# Altium schematic sheet LAN9254_B_P2.SchDoc
size 431 x 279 mm; DocumentNumber: 13; SheetNumber: 7; SheetTotal: 13
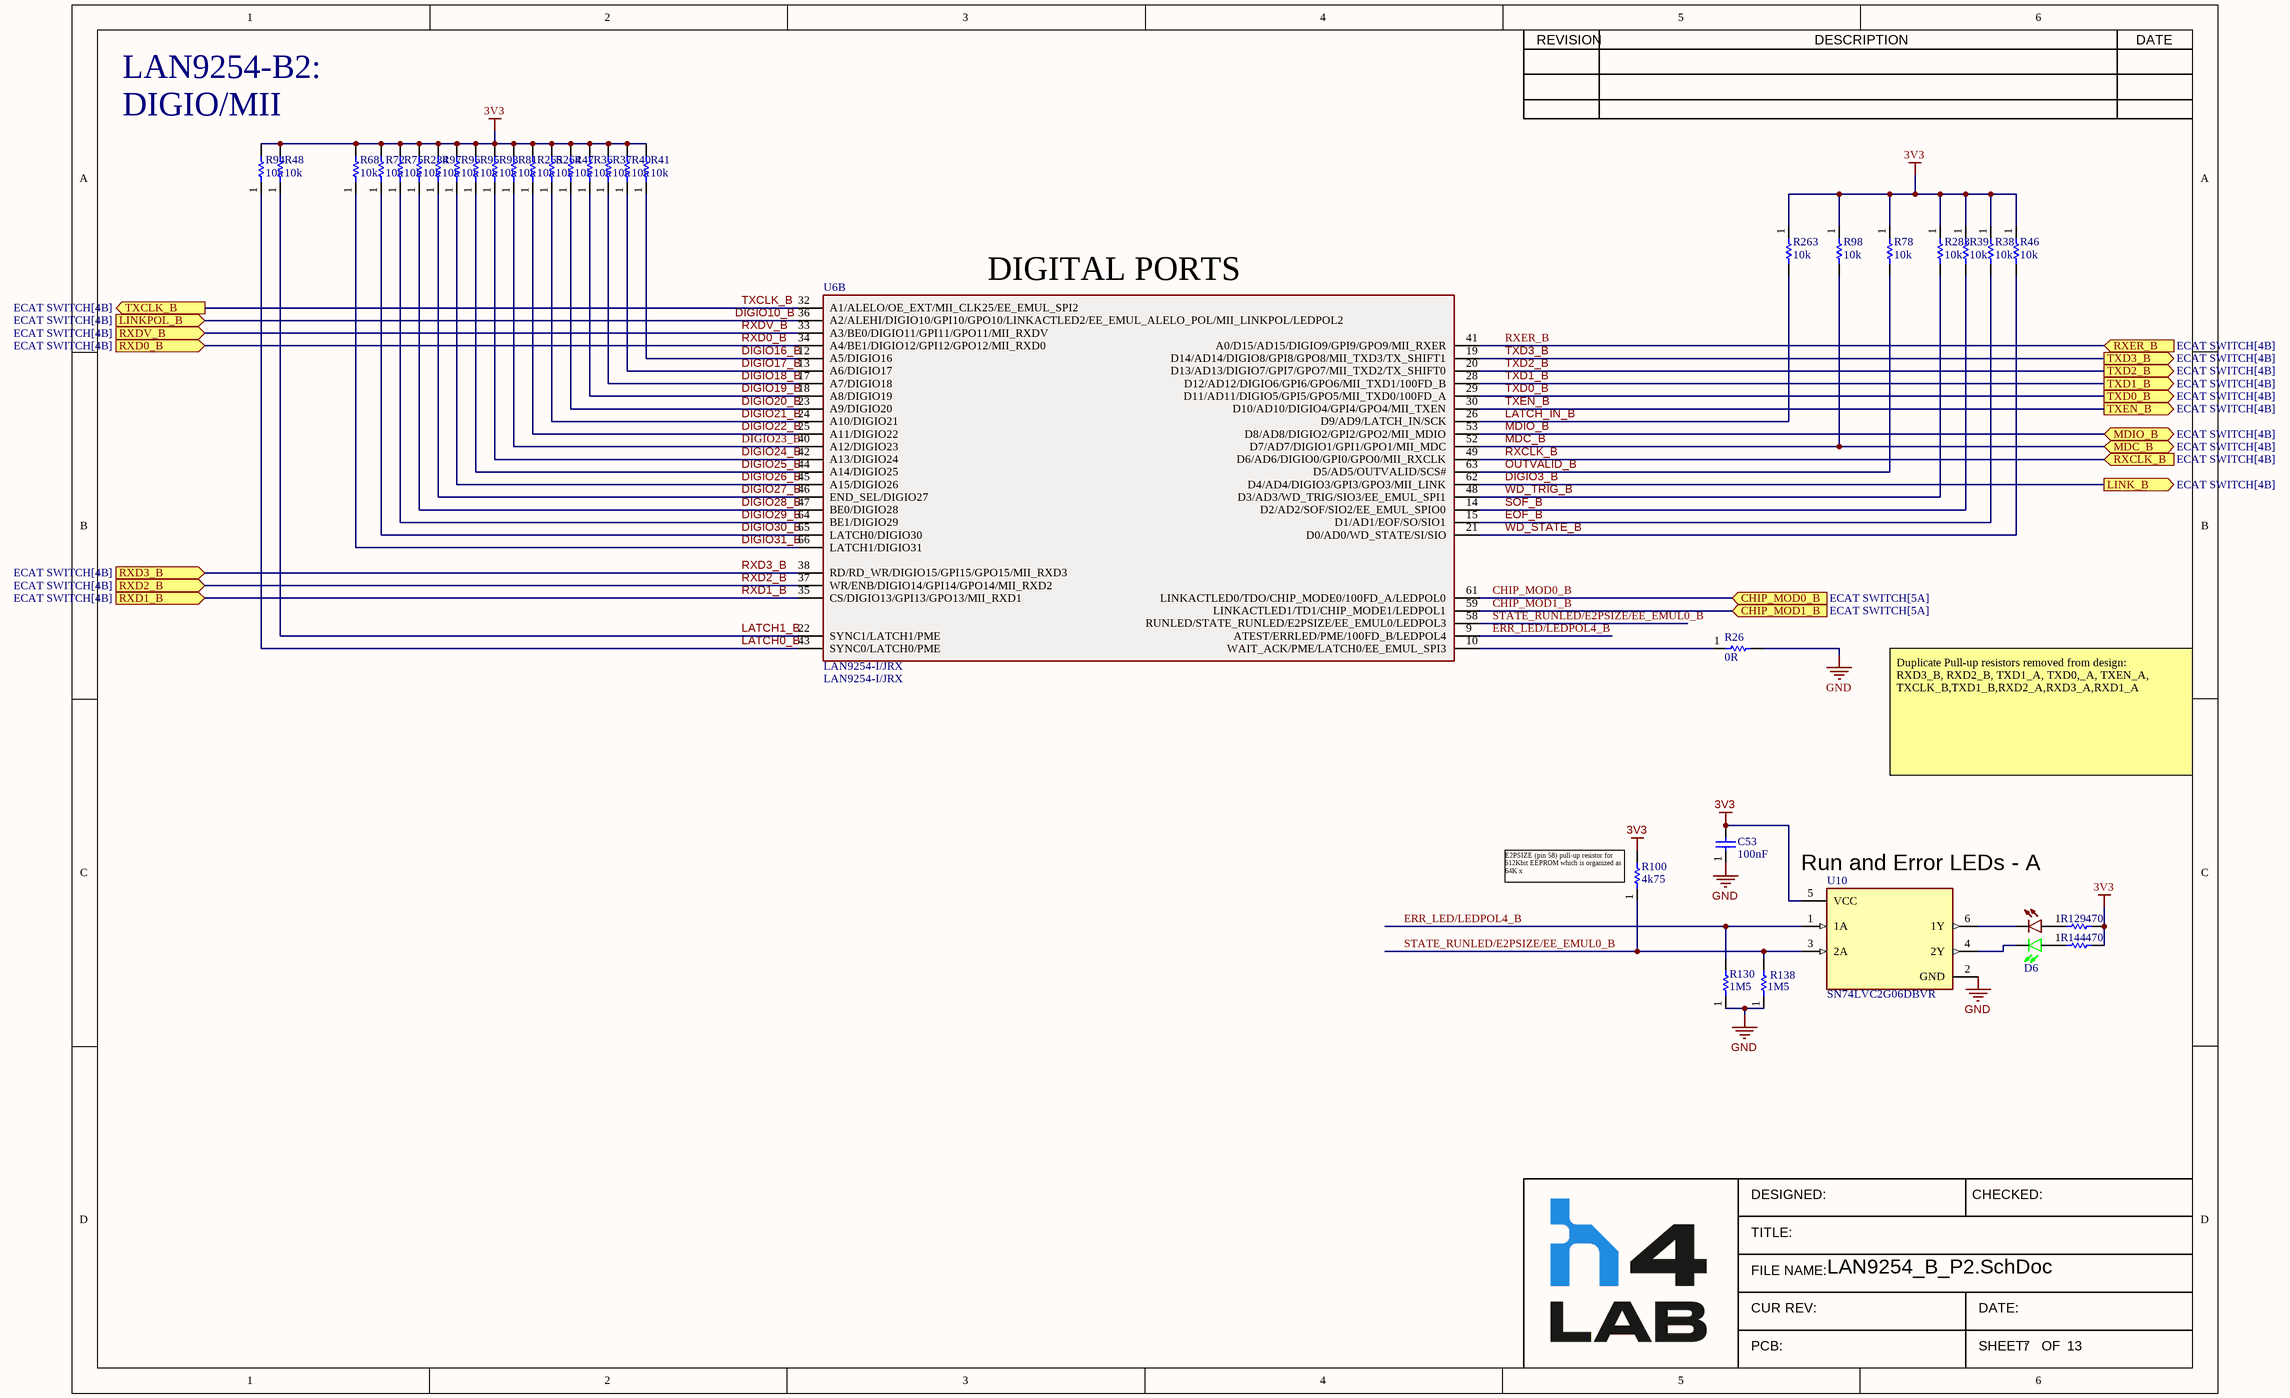
[diagram p0: LAN9254_B_P2.SchDoc]

## Parts
C53  value 100nF  [CAPC1005X03N(0402)]  (hidden comment: GRM155R71C104JA88D)
D6  LTST-C195KGJRKT  [Dual_LED]  (value not drawn)
R26  value 0R  [0402]  (hidden comment: RCS04020000Z0ED)
R36  value 10k  [RESC1005X06N(0402)]  (hidden comment: RC0402FR-0710KL)
R37  value 10k  [RESC1005X06N(0402)]  (hidden comment: RC0402FR-0710KL)
R38  value 10k  [RESC1005X06N(0402)]  (hidden comment: RC0402FR-0710KL)
R39  value 10k  [RESC1005X06N(0402)]  (hidden comment: RC0402FR-0710KL)
R40  value 10k  [RESC1005X06N(0402)]  (hidden comment: RC0402FR-0710KL)
R41  value 10k  [RESC1005X06N(0402)]  (hidden comment: RC0402FR-0710KL)
R46  value 10k  [RESC1005X06N(0402)]  (hidden comment: RC0402FR-0710KL)
R47  value 10k  [RESC1005X06N(0402)]  (hidden comment: RC0402FR-0710KL)
R48  value 10k  [RESC1005X06N(0402)]  (hidden comment: RC0402FR-0710KL)
R68  value 10k  [RESC1005X06N(0402)]  (hidden comment: RC0402FR-0710KL)
R72  value 10k  [RESC1005X06N(0402)]  (hidden comment: RC0402FR-0710KL)
R75  value 10k  [RESC1005X06N(0402)]  (hidden comment: RC0402FR-0710KL)
R78  value 10k  [RESC1005X06N(0402)]  (hidden comment: RC0402FR-0710KL)
R81  value 10k  [RESC1005X06N(0402)]  (hidden comment: RC0402FR-0710KL)
R93  value 10k  [RESC1005X06N(0402)]  (hidden comment: RC0402FR-0710KL)
R94  value 10k  [RESC1005X06N(0402)]  (hidden comment: RC0402FR-0710KL)
R95  value 10k  [RESC1005X06N(0402)]  (hidden comment: RC0402FR-0710KL)
R96  value 10k  [RESC1005X06N(0402)]  (hidden comment: RC0402FR-0710KL)
R97  value 10k  [RESC1005X06N(0402)]  (hidden comment: RC0402FR-0710KL)
R98  value 10k  [RESC1005X06N(0402)]  (hidden comment: RC0402FR-0710KL)
R100  value 4k75  [RESC1005X06N(0402)]  (hidden comment: RC0402FR-074K75L)
R129  value 470  [0402]  (hidden comment: CRCW0402470RJNED)
R130  value 1M5  [0402]  (hidden comment: CRCW04021M50JNED)
R138  value 1M5  [0402]  (hidden comment: CRCW04021M50JNED)
R144  value 470  [0402]  (hidden comment: CRCW0402470RJNED)
R263  value 10k  [RESC1005X06N(0402)]  (hidden comment: RC0402FR-0710KL)
R264  value 10k  [RESC1005X06N(0402)]  (hidden comment: RC0402FR-0710KL)
R265  value 10k  [RESC1005X06N(0402)]  (hidden comment: RC0402FR-0710KL)
R283  value 10k  [RESC1005X06N(0402)]  (hidden comment: RC0402FR-0710KL)
R284  value 10k  [RESC1005X06N(0402)]  (hidden comment: RC0402FR-0710KL)
U6  LAN9254-I/JRX  [QFP50P1400X1400X120-81N]  (part B of 2)
U10  SN74LVC2G06DBVR  [FP-DBV0006A-IPC_C]

## Ports
CHIP_MOD0_B (in, see ECAT SWITCH[5A]), CHIP_MOD1_B (in, see ECAT SWITCH[5A]), LINK_B (out, see ECAT SWITCH[4B]), LINKPOL_B (in, see ECAT SWITCH[4B]), MDC_B (bidir, see ECAT SWITCH[4B]), MDIO_B (bidir, see ECAT SWITCH[4B]), RXCLK_B (in, see ECAT SWITCH[4B]), RXD0_B (in, see ECAT SWITCH[4B]), RXD1_B (in, see ECAT SWITCH[4B]), RXD2_B (in, see ECAT SWITCH[4B]), RXD3_B (in, see ECAT SWITCH[4B]), RXDV_B (in, see ECAT SWITCH[4B]), RXER_B (in, see ECAT SWITCH[4B]), TXCLK_B (out, see ECAT SWITCH[4B]), TXD0_B (out, see ECAT SWITCH[4B]), TXD1_B (out, see ECAT SWITCH[4B]), TXD2_B (out, see ECAT SWITCH[4B]), TXD3_B (out, see ECAT SWITCH[4B]), TXEN_B (out, see ECAT SWITCH[4B])

## Nets
3V3: C53.2 R36.2 R37.2 R38.1 R39.1 R40.2 R41.2 R46.1 R47.2 R48.2 R68.2 R72.2 R75.2 R78.1 R81.2 R93.2 R94.2 R95.2 R96.2 R97.2 R98.1 R100.2 R129.2 R144.2 R263.1 R264.2 R265.2 R283.1 R284.2 U10.5(VCC)
GND: C53.1 R26.2 R130.1 R138.1 U10.2(GND)
CHIP_MOD0_B: U6.61(LINKACTLED0/TDO/CHIP_MODE0/100FD_A/LEDPOL0) ; port CHIP_MOD0_B
CHIP_MOD1_B: U6.59(LINKACTLED1/TD1/CHIP_MODE1/LEDPOL1) ; port CHIP_MOD1_B
DIGIO3_B: U6.62(D4/AD4/DIGIO3/GPI3/GPO3/MII_LINK) ; port LINK_B
DIGIO10_B: U6.36(A2/ALEHI/DIGIO10/GPI10/GPO10/LINKACTLED2/EE_EMUL_ALELO_POL/MII_LINKPOL/LEDPOL2) ; port LINKPOL_B
DIGIO16_B: R41.1 U6.12(A5/DIGIO16)
DIGIO17_B: R40.1 U6.13(A6/DIGIO17)
DIGIO18_B: R37.1 U6.17(A7/DIGIO18)
DIGIO19_B: R36.1 U6.18(A8/DIGIO19)
DIGIO20_B: R47.1 U6.23(A9/DIGIO20)
DIGIO21_B: R264.1 U6.24(A10/DIGIO21)
DIGIO22_B: R265.1 U6.25(A11/DIGIO22)
DIGIO23_B: R81.1 U6.40(A12/DIGIO23)
DIGIO24_B: R93.1 U6.42(A13/DIGIO24)
DIGIO25_B: R95.1 U6.44(A14/DIGIO25)
DIGIO26_B: R96.1 U6.45(A15/DIGIO26)
DIGIO27_B: R97.1 U6.46(END_SEL/DIGIO27)
DIGIO28_B: R284.1 U6.47(BE0/DIGIO28)
DIGIO29_B: R75.1 U6.64(BE1/DIGIO29)
DIGIO30_B: R72.1 U6.65(LATCH0/DIGIO30)
DIGIO31_B: R68.1 U6.66(LATCH1/DIGIO31)
EOF_B: R38.2 U6.15(D1/AD1/EOF/SO/SIO1)
ERR_LED/LEDPOL4_B: R130.2 U6.9(ATEST/ERRLED/PME/100FD_B/LEDPOL4) U10.1(1A)
LATCH0_B: R94.1 U6.43(SYNC0/LATCH0/PME)
LATCH1_B: R48.1 U6.22(SYNC1/LATCH1/PME)
LATCH_IN_B: R263.2 U6.26(D9/AD9/LATCH_IN/SCK)
MDC_B: R98.2 U6.52(D7/AD7/DIGIO1/GPI1/GPO1/MII_MDC) ; port MDC_B
MDIO_B: U6.53(D8/AD8/DIGIO2/GPI2/GPO2/MII_MDIO) ; port MDIO_B
OUTVALID_B: R78.2 U6.63(D5/AD5/OUTVALID/SCS#)
RXCLK_B: U6.49(D6/AD6/DIGIO0/GPI0/GPO0/MII_RXCLK) ; port RXCLK_B
RXD0_B: U6.34(A4/BE1/DIGIO12/GPI12/GPO12/MII_RXD0) ; port RXD0_B
RXD1_B: U6.35(CS/DIGIO13/GPI13/GPO13/MII_RXD1) ; port RXD1_B
RXD2_B: U6.37(WR/ENB/DIGIO14/GPI14/GPO14/MII_RXD2) ; port RXD2_B
RXD3_B: U6.38(RD/RD_WR/DIGIO15/GPI15/GPO15/MII_RXD3) ; port RXD3_B
RXDV_B: U6.33(A3/BE0/DIGIO11/GPI11/GPO11/MII_RXDV) ; port RXDV_B
RXER_B: U6.41(A0/D15/AD15/DIGIO9/GPI9/GPO9/MII_RXER) ; port RXER_B
SOF_B: R39.2 U6.14(D2/AD2/SOF/SIO2/EE_EMUL_SPIO0)
STATE_RUNLED/E2PSIZE/EE_EMUL0_B: R100.1 R138.2 U6.58(RUNLED/STATE_RUNLED/E2PSIZE/EE_EMUL0/LEDPOL3) U10.3(2A)
TXCLK_B: U6.32(A1/ALELO/OE_EXT/MII_CLK25/EE_EMUL_SPI2) ; port TXCLK_B
TXD0_B: U6.29(D11/AD11/DIGIO5/GPI5/GPO5/MII_TXD0/100FD_A) ; port TXD0_B
TXD1_B: U6.28(D12/AD12/DIGIO6/GPI6/GPO6/MII_TXD1/100FD_B) ; port TXD1_B
TXD2_B: U6.20(D13/AD13/DIGIO7/GPI7/GPO7/MII_TXD2/TX_SHIFT0) ; port TXD2_B
TXD3_B: U6.19(D14/AD14/DIGIO8/GPI8/GPO8/MII_TXD3/TX_SHIFT1) ; port TXD3_B
TXEN_B: U6.30(D10/AD10/DIGIO4/GPI4/GPO4/MII_TXEN) ; port TXEN_B
WD_STATE_B: R46.2 U6.21(D0/AD0/WD_STATE/SI/SIO)
WD_TRIG_B: R283.2 U6.48(D3/AD3/WD_TRIG/SIO3/EE_EMUL_SPI1)
NetD6_1: D6.1 R144.1
NetD6_2: D6.2 R129.1
NetD6_3: D6.3 U10.4(2Y)
NetD6_4: D6.4 U10.6(1Y)
NetR26_1: R26.1 U6.10(WAIT_ACK/PME/LATCH0/EE_EMUL_SPI3)

## Notes on the sheet
- LAN9254-B2:
- DIGIO/MII
- (near U6) DIGITAL PORTS
- Duplicate Pull-up resistors removed from design:
  RXD3_B, RXD2_B, TXD1_A, TXD0,_A, TXEN_A, TXCLK_B,TXD1_B,RXD2_A,RXD3_A,RXD1_A
- (near R100) E2PSIZE (pin 58) pull-up resistor for 512Kbit EEPROM which is organized as 64K x
- (near U10) Run and Error LEDs - A
- REVISION
- DESCRIPTION
- DATE
- DESIGNED:
- CHECKED:
- TITLE:
- FILE NAME:
- CUR REV:
- PCB:
- SHEET:
- DATE:
- OF

## Library data of the parts
C53 = 100nF_16V_0402_CAP: CAP CER 0.1UF 16V X7R 0402; Tolerance: 5%; MPN: GRM155R71C104JA88D; Voltage Rating: 16V; Temp Coeff: X7R; Size/Package: 0402
D6 = Green/Red_LED: LED GREEN/RED CLEAR CHIP SMD; Color: Green, Red; Voltage Vf: 2V Green, 2V Red; Current If: 20mA. 20mA; MPN: LTST-C195KGJRKT; Mounting Type: SMD; Supplier 1: Digi-Key; Supplier Part Number 1: 160-1452-1-ND
R26 = 0R_1/5W_0402_RCS04020000Z0ED_RES: VISHAY - RCS04020000Z0ED - SMD Chip Resistor, 0402 [1005 Metric], 0 ohm, RCS Series, 50 V, Thick Film, 200 mW; Manufacturer: Vishay Dale; Resistance: 0mR; Max Power Dissipation: 200mW; Supplier 1: Digi-Key; Supplier Part Number 1: 541-2877-1-ND; Manufacturer Part Number: RCS04020000Z0ED; RoHS: Yes; Category: Chip SMD Resistors; Stock 1: 18214; Pricing 1: 1=0.10000, 10=0.08300, 25=0.05760, 50=0.04480, 100=0.03200, 250=0.02496, 500=0.01984, 1000=0.01408, 5000=0.01088 (USD); Case/Package: 0402; Case Code (Metric): 1005; Case Code (Imperial): 0402; Min Operating Temperature: -55°C; Max Operating Temperature: 155°C; Packaging: Tape and Reel; Resistor Type: Thick Film; Number of Terminations: 2; Features: Automotive AEC-Q200; Length: 0.039inch; Width: 0.02inch; Height: 0.016inch; RoHS Compliant: Yes; ComponentLink1URL: http://www.farnell.com/datasheets/2618474.pdf?src-supplier=Farnell; ComponentLink1Description: http://www.farnell.com/datasheets/2618474.pdf?src-supplier=Farnell; ComponentLink2URL: http://www.vishay.com/docs/20065/rcse3.pdf?src-supplier=Digi-Key; ComponentLink2Description: http://www.vishay.com/docs/20065/rcse3.pdf?src-supplier=Digi-Key; ComponentLink3URL: http://www.farnell.com/datasheets/2618474.pdf?src-supplier=Element14; ComponentLink3Description: http://www.farnell.com/datasheets/2618474.pdf?src-supplier=Element14; ComponentLink4URL: http://www.farnell.com/datasheets/2618474.pdf?src-supplier=Newark; ComponentLink4Description: http://www.farnell.com/datasheets/2618474.pdf?src-supplier=Newark
R36-R41 R46-R48 R68 R72 R75 R78 R81 R93-R98 R263-R265 R283 R284 = 10k_1/16W_0402_RES: RES SMD 10K OHM 1% 1/16W 0402; MPN: RC0402FR-0710KL; Tolerance: 1%; Power: 1/16W; Size: 0402
R100 = 4k75_1/16_0402_RES: RES SMD 4.75K OHM 1% 1/16W 0402; Power: 1/16; MPN: RC0402FR-074K75L; Tolerance: 1%; Package/Case: 0402
R129 R144 = 470_1/10W_0402_CRCW0402470RJNED: Vishay CRCW Series Thick Film Resistor 0402 Case 470 5% 0.063W 200ppm/K; Manufacturer: Vishay Dale; Resistance: 470R; Max Power Dissipation: 63mW; Temperature Coefficient: 200ppm/°C; Voltage Rating: 50V; Supplier 1: Digi-Key; Manufacturer Part Number: CRCW0402470RJNED; RoHS: Yes; Category: Chip SMD Resistors; Pricing 1: 1=0,10000, 10=0,03300, 100=0,01360, 1000=0,00610, 2500=0,00529, 5000=0,00437 (USD); Case/Package: 0402; Number of Pins: 2; Weight: 2.3E-05oz; Case Code (Metric): 1005; Case Code (Imperial): 0402; Contact Plating: Tin; Min Operating Temperature: -55°C; Max Operating Temperature: 155°C; Packaging: Tape and Reel; Tolerance: 5%; Package Quantity: 1; Resistor Type: Thick Film; Number of Terminations: 2; Features: Automotive AEC-Q200; Power Rating: 63mW; Termination: SMD/SMT; Series: CRCW; Voltage Rating (DC): 50V; Resistance Tolerance: 5%; Construction: Rectangular; Technology: THICK FILM; Length: 1mm; Width: 0.02inch; Height: 0.35mm; Depth: 0.5mm; Radiation Hardening: No; RoHS Compliant: Yes; Lead Free: Lead Free; Military Standard: Not; REACH SVHC: Unknown; ComponentLink1URL: https://datasheet.ciiva.com/2461/dcrcwe3-2461992.pdf?src-supplier=Digi-Key; ComponentLink1Description: https://datasheet.ciiva.com/2461/dcrcwe3-2461992.pdf?src-supplier=Digi-Key; ComponentLink2URL: https://datasheet.ciiva.com/2461/dcrcwe3-2461993.pdf?src-supplier=Digi-Key; ComponentLink2Description: https://datasheet.ciiva.com/2461/dcrcwe3-2461993.pdf?src-supplier=Digi-Key; ComponentLink3URL: https://datasheet.ciiva.com/2461/dcrcwe3-2461994.pdf?src-supplier=Digi-Key; ComponentLink3Description: https://datasheet.ciiva.com/2461/dcrcwe3-2461994.pdf?src-supplier=Digi-Key; ComponentLink4URL: https://datasheet.ciiva.com/5550/dcrcwe3-109170-5550440.pdf?src-supplier=Mouser; ComponentLink4Description: https://datasheet.ciiva.com/5550/dcrcwe3-109170-5550440.pdf?src-supplier=Mouser; ComponentLink5URL: https://datasheet.ciiva.com/3256/dcrcwe3-3256554.pdf?src-supplier=Avnet; ComponentLink5Description: https://datasheet.ciiva.com/3256/dcrcwe3-3256554.pdf?src-supplier=Avnet; ComponentLink6URL: https://datasheet.ciiva.com/8336/dcrcwe3-8336717.pdf?src-supplier=Avnet; ComponentLink6Description: https://datasheet.ciiva.com/8336/dcrcwe3-8336717.pdf?src-supplier=Avnet; ComponentLink7URL: https://datasheet.ciiva.com/28571/1847332-28571880.pdf?src-supplier=Element14; ComponentLink7Description: https://datasheet.ciiva.com/28571/1847332-28571880.pdf?src-supplier=Element14; Supplier Part Number 1: 541-470JDKR-ND
R130 R138 = 1M5_1/16W_0402_CRCW04021M50JNED_RES: RES SMD 1.5M OHM 5% 1/16W 0402; Manufacturer: Vishay Dale; Resistance: 1.5MR; Power Rating: 63mW; Voltage Rating: 50V; Temperature Coefficient: 200ppm/°C; Supplier 1: Digi-Key; Manufacturer Part Number: CRCW04021M50JNED; RoHS: Yes; Category: Chip SMD Resistors; Stock 1: 7870; Pricing 1: 1=0,10000, 10=0,03300, 100=0,01360, 1000=0,00610, 2500=0,00529, 5000=0,00437 (USD); Case/Package: 0402; Weight: 2.3E-05oz; Case Code (Imperial): 0402; Case Code (Metric): 1005; Contact Plating: Tin; Min Operating Temperature: -55°C; Max Operating Temperature: 155°C; Tolerance: 5%; Package Quantity: 1; Packaging: Tape and Reel; Termination: SMD/SMT; Resistor Type: Thick Film; Number of Terminations: 2; Max Power Dissipation: 63mW; Voltage Rating (DC): 50V; Features: Automotive AEC-Q200; Series: CRCW; Construction: Rectangular; Length: 1mm; Width: 0.5mm; Height: 0.016inch; Depth: 0.5mm; Radiation Hardening: No; RoHS Compliant: Yes; Military Standard: Not; Lead Free: Lead Free; ComponentLink1URL: https://datasheet.ciiva.com/9100/dcrcwe3-9100251.pdf?src-supplier=Avnet; ComponentLink1Description: https://datasheet.ciiva.com/9100/dcrcwe3-9100251.pdf?src-supplier=Avnet; ComponentLink2URL: https://datasheet.ciiva.com/2493/dcrcwe3-2493529.pdf?src-supplier=Digi-Key; ComponentLink2Description: https://datasheet.ciiva.com/2493/dcrcwe3-2493529.pdf?src-supplier=Digi-Key; ComponentLink3URL: https://datasheet.ciiva.com/2493/dcrcwe3-2493530.pdf?src-supplier=Digi-Key; ComponentLink3Description: https://datasheet.ciiva.com/2493/dcrcwe3-2493530.pdf?src-supplier=Digi-Key; ComponentLink4URL: https://datasheet.ciiva.com/2493/dcrcwe3-2493531.pdf?src-supplier=Digi-Key; ComponentLink4Description: https://datasheet.ciiva.com/2493/dcrcwe3-2493531.pdf?src-supplier=Digi-Key; Supplier Part Number 1: 541-1.5MJCT-ND
U6 = LAN9254-I/JRX: 2/3-PORT Ethercat Slave Controller With 32 Digios With Integrated Ethernet Phys; Manufacturer: Microchip; Supplier 1: Digi-Key; Manufacturer Part Number: LAN9254-I/JRX; RoHS: Yes; Pricing 1: 1=14.24000, 25=12.99000 (USD); RoHS Compliant: Yes; Supplier Part Number 1: 150-LAN9254-I/JRX-ND
U10 = BUF_dual_SN74LVC2G06DBVR: Buffer/Driver 2-CH Inverting Open Drain CMOS 6-Pin SOT-23 T/R; Manufacturer: Texas Instruments; Number of Channels: 2; Propagation Delay: 2.9ns; Min Supply Voltage: 1.65V; High Level Output Current: 32mA; Logic Function: Buffer; Max Supply Voltage: 5.5V; Nominal Supply Current: 40mA; Turn-On Delay Time: 7.2ns; Quiescent Current: 10uA; Number of Inputs: 1; Height: 1.15mm; Radiation Hardening: No; Length: 2.9mm; Number of Output Lines: 2; Package Quantity: 3000; Min Operating Temperature: -40°C; Case/Package: SOT-23; REACH SVHC: No SVHC; Number of Elements: 2; Number of Pins: 6; Mount: Surface Mount; Polarity: Inverting; Contact Plating: Gold; Number of Input Lines: 2; Number of Outputs: 2; Number of Circuits: 2; Number of Gates: 2; Max Operating Temperature: 125°C; RoHS Compliant: Yes; Low Level Output Current: 32mA; Number of Bits: 2; Width: 1.6mm; Packaging: Tape and Reel; Lead Free: Lead Free; Supplier 1: Digi-Key; Manufacturer Part Number: SN74LVC2G06DBVR; RoHS: Yes; Category: Logic Gates; Stock 1: 3468; Pricing 1: 1=0,47000, 10=0,35600, 25=0,32080, 100=0,22150, 250=0,18656, 500=0,15158, 1000=0,11660 (USD); ComponentLink1URL: https://datasheet.ciiva.com/22719/1737061-22719510.pdf?src-supplier=Element14; ComponentLink1Description: https://datasheet.ciiva.com/22719/1737061-22719510.pdf?src-supplier=Element14; ComponentLink2URL: https://datasheet.ciiva.com/7293/sn74lvc2g06-7293674.pdf?src-supplier=Newark; ComponentLink2Description: https://datasheet.ciiva.com/7293/sn74lvc2g06-7293674.pdf?src-supplier=Newark; ComponentLink3URL: https://datasheet.ciiva.com/46439/1786796-46439655.pdf?src-supplier=Element14; ComponentLink3Description: https://datasheet.ciiva.com/46439/1786796-46439655.pdf?src-supplier=Element14; ComponentLink4URL: https://datasheet.ciiva.com/1864/sn74lvc2g06-1864312.pdf?src-supplier=Digi-Key; ComponentLink4Description: https://datasheet.ciiva.com/1864/sn74lvc2g06-1864312.pdf?src-supplier=Digi-Key; ComponentLink5URL: https://datasheet.ciiva.com/1864/sn74lvc2g06-1864311.pdf?src-supplier=Digi-Key; ComponentLink5Description: https://datasheet.ciiva.com/1864/sn74lvc2g06-1864311.pdf?src-supplier=Digi-Key; ComponentLink6URL: https://datasheet.ciiva.com/1864/sn74lvc2g06-1864313.pdf?src-supplier=Digi-Key; ComponentLink6Description: https://datasheet.ciiva.com/1864/sn74lvc2g06-1864313.pdf?src-supplier=Digi-Key; ComponentLink7URL: https://datasheet.ciiva.com/14301/sn74lvc2g06-14301182.pdf?src-supplier=Avnet; ComponentLink7Description: https://datasheet.ciiva.com/14301/sn74lvc2g06-14301182.pdf?src-supplier=Avnet; ComponentLink8URL: https://datasheet.ciiva.com/26220/sn74lvc2g06-26220937.pdf?src-supplier=Avnet+Europe; ComponentLink8Description: https://datasheet.ciiva.com/26220/sn74lvc2g06-26220937.pdf?src-supplier=Avnet+Europe; Supplier Part Number 1: 296-13492-1-ND